# EAGLE design pc (EAGLE 6.3)
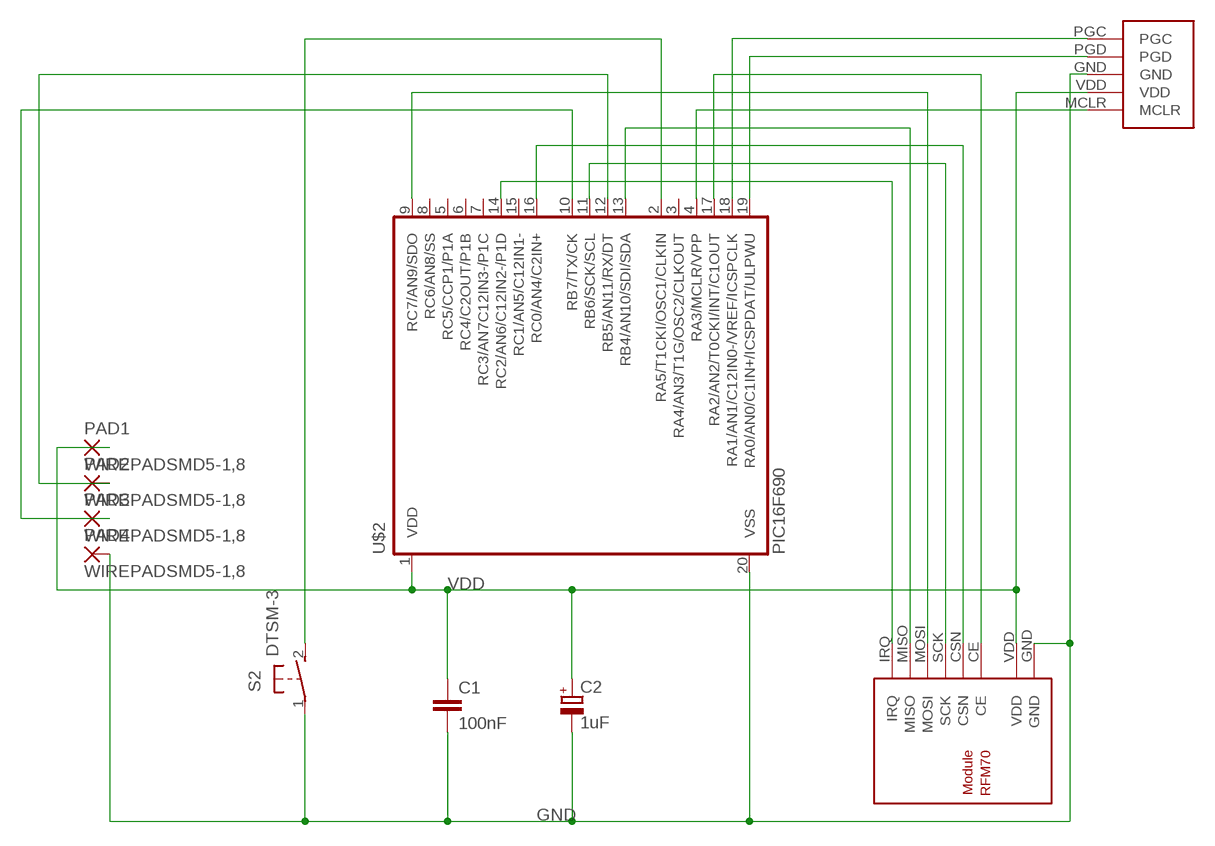
[diagram p0: schematic, sheet 1]

## Parts
C1  100nF  C-EUC2012  [C2012]
C2  1uF  CPOL-EUSMCA  [SMC_A]
PAD1  WIREPADSMD5-1,8  [5-1,8]
PAD2  WIREPADSMD5-1,8  [5-1,8]
PAD3  WIREPADSMD5-1,8  [5-1,8]
PAD4  WIREPADSMD5-1,8  [5-1,8]
S2  DTSM-3  [DTSM-3]
U$1  RFM70  [RFM70]
U$2  PIC16F690  [SSOP20]
U$3  PROGRAMMINGHEADERDIP  [PROGHEADER]

## Nets
GND: C1.2 C2.- PAD4.1(P) S2.1 U$1.GND U$2.20(VSS) U$3.GND
N$1: S2.2 U$2.2(RA5/T1CKI/OSC1/CLKIN)
N$2: U$2.18(RA1/AN1/C12IN0-/VREF/ICSPCLK) U$3.PGC
N$12: U$1.MISO U$2.13(RB4/AN10/SDI/SDA)
N$16: U$1.CE U$2.17(RA2/AN2/T0CKI/INT/C1OUT)
N$18: U$2.19(RA0/AN0/C1IN+/ICSPDAT/ULPWU) U$3.PGD
N$20: U$1.CSN U$2.16(RC0/AN4/C2IN+)
N$21: U$1.IRQ U$2.14(RC2/AN6/C12IN2-/P1D)
N$22: U$1.SCK U$2.11(RB6/SCK/SCL)
N$23: U$1.MOSI U$2.9(RC7/AN9/SDO)
N$25: U$2.4(RA3/MCLR/VPP) U$3.MCLR
N$33: PAD3.1(P) U$2.10(RB7/TX/CK)
N$34: PAD2.1(P) U$2.12(RB5/AN11/RX/DT)
VDD: C1.1 C2.+ PAD1.1(P) U$1.VDD U$2.1(VDD) U$3.VDD
Unconnected: U$2.3(RA4/AN3/T1G/OSC2/CLKOUT) U$2.5(RC5/CCP1/P1A) U$2.6(RC4/C2OUT/P1B) U$2.7(RC3/AN7C12IN3-/P1C) U$2.8(RC6/AN8/SS) U$2.15(RC1/AN5/C12IN1-)

## Library data of the parts
C1 = resistor:C-EU: CAPACITOR, European symbol
C2 = resistor:CPOL-EU: POLARIZED CAPACITOR, European symbol
PAD1-PAD4 = wirepad:WIREPAD: Wire PAD connect wire on PCB
S2 = switch-tact:DTSM-3
U$1 = rfm70:RFM70: RFM70 2.4 Ghz Funkmodul Autor: Daniel Weber Website: http://projects.web4clans.com Email: daniel.weber@web4clans.com
U$2 = microchip:PIC16F690*: MICROCONTROLLER PIC16F690 18 I/O One 16-bit timer Two 8-bit timer Two comparators Precision internal oscillator-software selectable 8 MHz - 32 KHz SSP w/ I2C Compatible Address mask option EUSART LIN 2.0 Compatible ECCP+ w/ PWM Steering 12 A/D Channels ULPW Enhanced Low Power Timer 1 Timer 1 Gate Synch Latch 4k Program Flash memory 256 bytes SRAM 256 bytes EEPROM
U$3 = rfm70:PROGRAMMINGHEADER

## Board
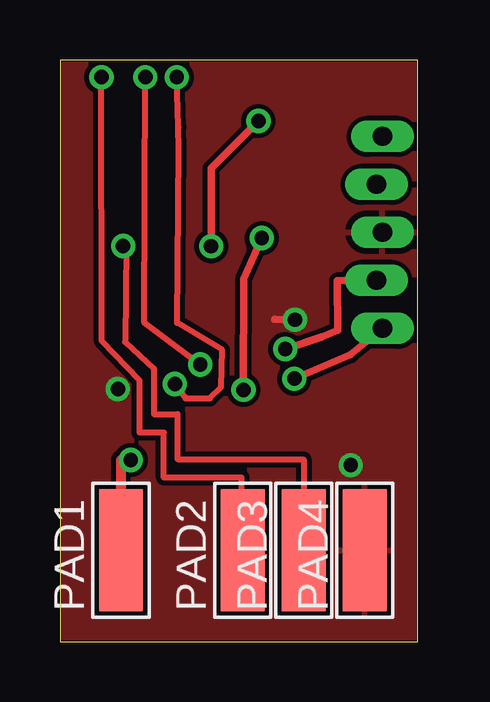
[diagram p1: board, top side]
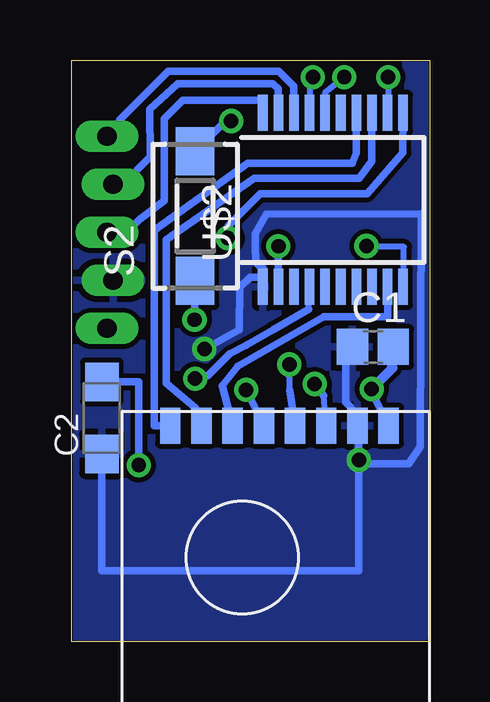
[diagram p2: board, bottom side, seen from below]

Size 14.91 x 24.23 mm. Coordinates in mm from the lower left corner, seen from the top.
Outline: 0,0 14.91,0 14.91,24.23 0,24.23 0,0
Copper layers (1*16): Top 0.035mm / dielectric 1.5mm / Bottom 0.035mm
Design rules "default *": minimum track width 10mil, minimum drill 24mil, track to track 8mil, track to pad 8mil, pad to pad 8mil, via to via 8mil, smd to smd 8mil, copper to edge 2mil, drill to drill 8mil, minimum pad ring 10mil, minimum via ring 8mil, stop-mask expansion 4mil, vias tented up to drill 0mil, thermal gap 10mil

### Footprints (pad centres in the part's own frame; a part is rotated, then mirrored left to right if it is on the bottom)
C2012 = smd 1.3 x 1.5: 1 -0.85,0; 2 0.85,0
SMC_A = smd 1.6 x 1.4: + -1.5,0; - 1.5,0
5-1,8 = smd 1.829 x 5.08: 1 0,0
DTSM-3 = smd 2 x 1.6: 1 -2.7,0; 2 2.7,0
RFM70 = smd 0.85 x 1.5: CE 2.5,-14.3; CSN 3.8,-14.3; GND -0.1,-14.3; IRQ 9,-14.3; MISO 7.7,-14.3; MOSI 6.4,-14.3; SCK 5.1,-14.3; VDD 1.2,-14.3
SSOP20 = smd 0.4 x 1.5: 1 -2.925,-3.625; 2 -2.275,-3.625; 3 -1.625,-3.625; 4 -0.975,-3.625; 5 -0.325,-3.625; 6 0.325,-3.625; 7 0.975,-3.625; 8 1.625,-3.625; 9 2.275,-3.625; 10 2.925,-3.625; 11 2.925,3.625; 12 2.275,3.625; 13 1.625,3.625; 14 0.975,3.625; 15 0.325,3.625; 16 -0.325,3.625; 17 -0.975,3.625; 18 -1.625,3.625; 19 -2.275,3.625; 20 -2.925,3.625
PROGHEADER = drill 0.8 long: GND 0,0; MCLR -4,0; PGC 4,0; PGD 2,0.25; VDD -2,0.25

### Placement (x,y rotation side)
C1  2.36,12.28 0 bottom
C2  13.65,9.32 90 bottom
PAD1  2.54,3.81 0 top
PAD2  7.62,3.81 0 top
PAD3  10.16,3.81 0 top
PAD4  12.7,3.81 0 top
S2  9.77,17.73 90 bottom
U$1  1.8,-5.3 180 bottom
U$2  4.03,18.4 0 bottom
U$3  13.44,17.06 90 top

### Tracks (layer width: path | path; a pad name or v marks a point on that pad's centre or on a via)
GND  (via drill 0.6)
  Top 0.254: v2.41,10.53 2.41,10.45 2.4,10.44
  Top 0.305: 12.7,5.51 13.14,5.07 | 8.94,13.42 v9.79,13.41 9.79,13.42
  Top 0.406: 13.14,5.07 12.09,3.83 12.7,3.83 PAD4.1
  Bottom 0.254: 2.44,10.44 v2.41,10.53
  Bottom 0.305: U$2.20 6.96,22.59 7.25,22.55 10.29,22.55 11.05,21.79 11.05,18.36 12.07,17.6 12.61,17.06 U$3.GND | U$1.GND 2.44,10.44 | 9.79,15.03 v9.79,13.41 | C2.- 12.12,10.82 v12.12,7.35
  Bottom 0.406: v2.41,10.53 1.55,11.39 1.55,12.24 C1.2 | S2.1 9.79,15.03
  pour Top: 0.13,24.09 14.78,24.09 14.78,0.13 0.17,0.15
N$1  (via drill 0.6)
  Top 0.305: v6.3,16.47 6.3,19.72 v8.27,21.69
  Bottom 0.305: U$2.2 v6.3,16.47 | v8.27,21.69 8.5,21.69 S2.2
N$2
  Bottom 0.305: U$2.18 5.65,23.14 6.29,23.77 10.88,23.77 12.92,21.74 12.92,21.34 U$3.PGC
N$12
  Bottom 0.305: U$1.MISO 9.77,9.74 10.97,10.77 10.97,16.74 7.32,19.32 2.92,19.32 2.41,20.02 2.41,21.4 U$2.13
N$16  (via drill 0.6)
  Top 0.254: v4.79,10.73 5.23,10.13 6.25,10.13 6.72,10.6 6.76,12.15 4.88,13.28 4.94,20.52 4.93,21.45 v4.86,23.52
  Bottom 0.254: U$1.CE 4.41,10.24 | v4.86,23.52 5,23.48 U$2.17
  Bottom 0.305: 4.41,10.24 v4.79,10.73
N$18
  Bottom 0.305: U$2.19 6.3,23.03 6.54,23.25 10.49,23.25 11.66,22.17 11.65,20.21 12.76,19.05 12.77,19.06 U$3.PGD
N$20  (via drill 0.6)
  Top 0.254: v5.84,11.54 3.52,13.28 v3.56,23.52
  Bottom 0.254: 5.82,10.47 v5.84,11.54 | v3.56,23.52 4.36,22.86 U$2.16
  Bottom 0.305: U$1.CSN 5.82,10.47
N$21
  Bottom 0.305: U$1.IRQ 11.47,9 11.48,10.65 11.48,17.15 7.57,19.94 3.21,19.94 3.06,20.36 3.06,21.17 U$2.14
N$22  (via drill 0.6)
  Top 0.305: v7.64,10.49 7.66,15.13 v8.41,16.82
  Bottom 0.305: U$1.SCK v7.64,10.48 v7.64,10.49 | v8.41,16.82 8.39,17.32 7.05,18.67 2.59,18.67 1.11,20.38 U$2.11
N$23
  Bottom 0.305: U$1.MOSI 8.63,10.67 7.99,11.48 4.41,13.54 1.74,13.54 U$2.9
N$25  (via drill 0.6)
  Top 0.305: v9.77,10.96 12.1,11.95 13.2,12.85 U$3.MCLR
  Bottom 0.254: 5.03,13.86 U$2.4
  Bottom 0.305: v9.77,10.96 9.23,11.07 8.32,11.99 7.63,12.36 6.51,13.01 5.03,13.86
N$33  (via drill 0.6)
  Top 0.254: 2.76,16.48 2.72,12.48 3.91,11.38 3.91,9.47 4.89,9.47 4.89,7.61 10.15,7.59 10.15,3.82
  Top 0.305: v2.63,16.48 2.76,16.48 | 10.15,3.82 PAD3.1
  Bottom 0.254: 1.07,14.78 1.07,16.45 2.63,16.45
  Bottom 0.305: U$2.10 1.07,14.78 | 2.63,16.45 v2.63,16.48
N$34  (via drill 0.6)
  Top 0.254: PAD2.1 7.57,6.83 4.33,6.83 4.33,8.71 3.31,8.71 3.31,10.87 1.74,12.52 v1.73,23.52
  Bottom 0.254: v1.73,23.52 1.73,22.78 U$2.12
VDD  (via drill 0.6)
  Top 0.305: v9.38,12.19 10.92,12.71 11.58,12.98 11.56,15.03 U$3.VDD
  Top 0.406: v2.95,7.57 2.54,7.57 PAD1.1
  Bottom 0.305: v9.38,12.19 7.94,12.99 7.91,14.76 7.48,15.19 6.95,15.19 6.98,14.98 6.95,14.98 | 6.95,14.99 6.95,15.01 7,15.01 7,14.9 6.95,14.9 6.95,14.98 | 6.95,14.98 6.95,14.99 | 6.95,14.99 U$2.1 | 2.95,9 v2.95,7.57 2.95,2.95 13.65,2.95 C2.+ | 3,9.48 3.49,9.97 3.49,11.85 | 6.95,15.51 7.24,15.8 7.24,15.84 7.26,16.51 7.26,16.99 6.79,17.8 0.36,17.82 0.38,8.13 0.88,7.4 2.78,7.4
  Bottom 0.406: 2.95,9 U$1.VDD 3,9.48 | 3.49,11.85 C1.1 | U$2.1 6.95,15.51 | 2.78,7.4 v2.95,7.57
  pour Bottom: 14.73,0.2 0.2,0.2 0.2,24.05 14.73,24.05